# EAGLE schematic smartHome (EAGLE 7.3.0)
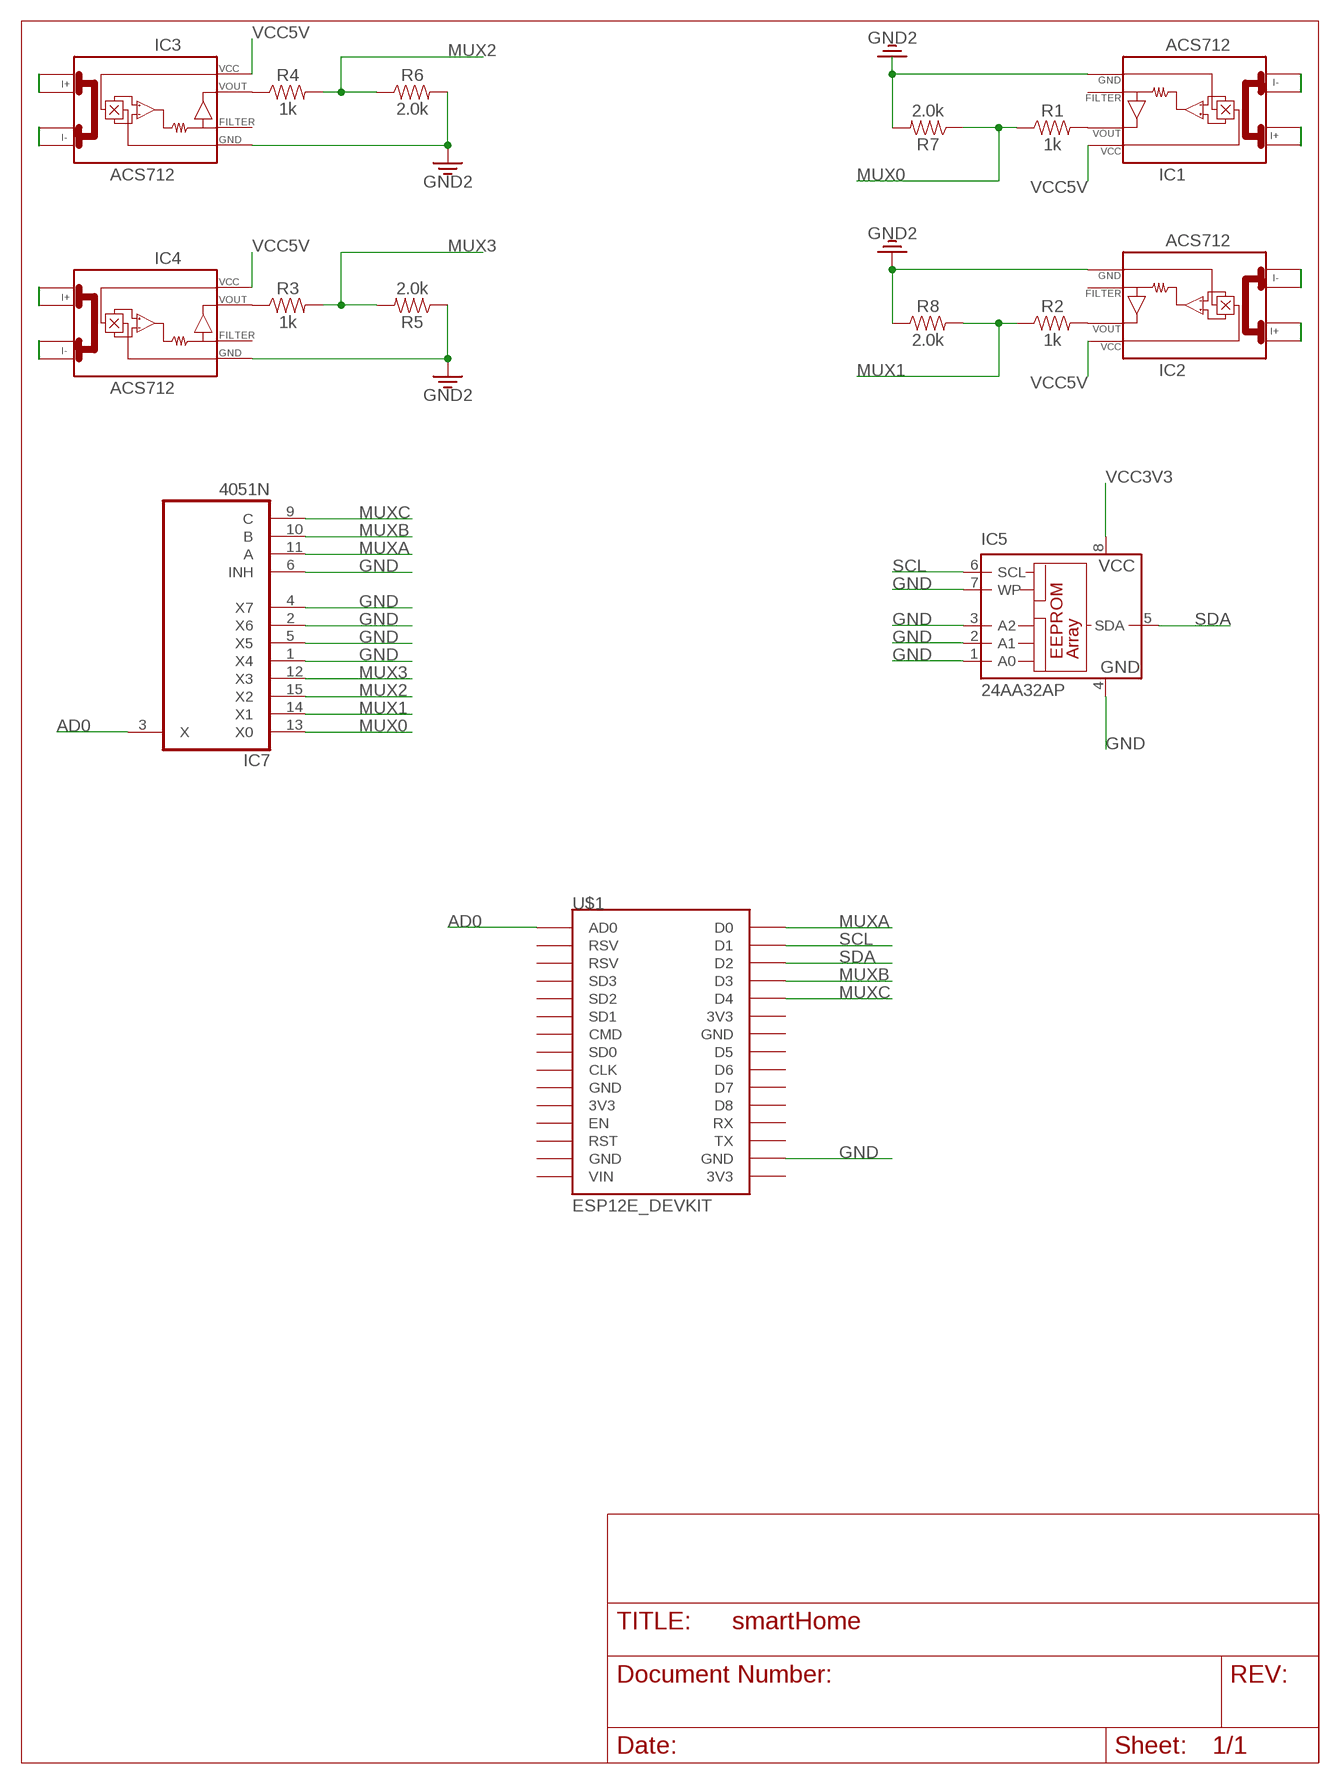
[diagram p0: schematic, sheet 1]

## Parts
IC1  ACS712  [SO08]
IC2  ACS712  [SO08]
IC3  ACS712  [SO08]
IC4  ACS712  [SO08]
IC5  24AA32AP  [DIL8]
IC7  4051N  [DIL16]
R1  1k  1KOHM-HORIZ-1/4W-1%  [AXIAL-0.3]
R2  1k  1KOHM-HORIZ-1/4W-1%  [AXIAL-0.3]
R3  1k  1KOHM-HORIZ-1/4W-1%  [AXIAL-0.3]
R4  1k  1KOHM-HORIZ-1/4W-1%  [AXIAL-0.3]
R5  2.0k  2.0KOHM-0603-1/10W-5%  [0603]
R6  2.0k  2.0KOHM-0603-1/10W-5%  [0603]
R7  2.0k  2.0KOHM-0603-1/10W-5%  [0603]
R8  2.0k  2.0KOHM-0603-1/10W-5%  [0603]
U$1  ESP12E_DEVKIT  [ESP12E_DEVKIT]

## Nets
AD0: IC7.3(X) U$1.AD0
GND: IC1.5(GND) IC2.5(GND) IC3.5(GND) IC4.5(GND) IC5.1(A0) IC5.2(A1) IC5.3(A2) IC5.4(GND) IC5.7(WP) IC7.1(X4) IC7.2(X6) IC7.4(X7) IC7.5(X5) IC7.6(INH) R5.1 R6.2 R7.2 R8.1 U$1.GND@3(GND) ; supply symbol labelled GND2
MUX0: IC7.13(X0) R1.P$1 R7.1
MUX1: IC7.14(X1) R2.P$1 R8.2
MUX2: IC7.15(X2) R4.P$2 R6.1
MUX3: IC7.12(X3) R3.P$2 R5.2
MUXA: IC7.11(A) U$1.D0
MUXB: IC7.10(B) U$1.D3
MUXC: IC7.9(C) U$1.D4
N$10: IC1.7(VOUT) R1.P$2
N$11: IC2.7(VOUT) R2.P$2
N$12: IC3.7(VOUT) R4.P$1
N$13: IC4.7(VOUT) R3.P$1
SCL: IC5.6(SCL) U$1.D1
SDA: IC5.5(SDA) U$1.D2
VCC3V3: IC5.8(VCC)
VCC5V: IC1.8(VCC) IC2.8(VCC) IC3.8(VCC) IC4.8(VCC)
Unconnected: IC1.1(I+_0) IC1.2(I+_1) IC1.3(I-_0) IC1.4(I-_1) IC1.6(FILTER) IC2.1(I+_0) IC2.2(I+_1) IC2.3(I-_0) IC2.4(I-_1) IC2.6(FILTER) IC3.1(I+_0) IC3.2(I+_1) IC3.3(I-_0) IC3.4(I-_1) IC3.6(FILTER) IC4.1(I+_0) IC4.2(I+_1) IC4.3(I-_0) IC4.4(I-_1) IC4.6(FILTER) U$1.3V3@0(3V3) U$1.3V3@1(3V3) U$1.3V3@2(3V3) U$1.CLK U$1.CMD U$1.D5 U$1.D6 U$1.D7 U$1.D8 U$1.EN U$1.GND@0(GND) U$1.GND@1(GND) U$1.GND@2(GND) U$1.RST U$1.RSV@0(RSV) U$1.RSV@1(RSV) U$1.RX U$1.SD0 U$1.SD1 U$1.SD2 U$1.SD3 U$1.TX U$1.VIN

## Power pins joined to a net without a drawn wire
GND: IC7.8(GND)
VCC: IC7.16(VCC)
VEE: IC7.7(VEE)

## Library data of the parts
IC1-IC4 = acs712:ACS712
IC5 = microchip:24*: Serial EEPROM I2C; MF: MICROCHIP; MPN: 24AA32A-I/P; OC_FARNELL: 1331297; OC_NEWARK: 92C6885
IC7 = 40xx:4051: 8-channel ANALOG MULTIPLEXER
R1-R4 = SparkFun-Resistors:1KOHM: 1kΩ resistor A resistor is a passive two-terminal electrical component that implements electrical resistance as a circuit element. Resistors act to reduce current flow, and, at the same time, act to lower voltage levels within circuits. - Wikipedia; PROD_ID: RES-12182
R5-R8 = SparkFun-Resistors:2.0KOHM: 2kΩ resistor A resistor is a passive two-terminal electrical component that implements electrical resistance as a circuit element. Resistors act to reduce current flow, and, at the same time, act to lower voltage levels within circuits. - Wikipedia; PROD_ID: RES-08296
U$1 = nodemcu:ESP12E_DEVKIT: ESP12E DEVKIT BOARD